# Altium schematic sheet A-01 BLOCK DIAGRAM.SchDoc
size 513 x 386 mm
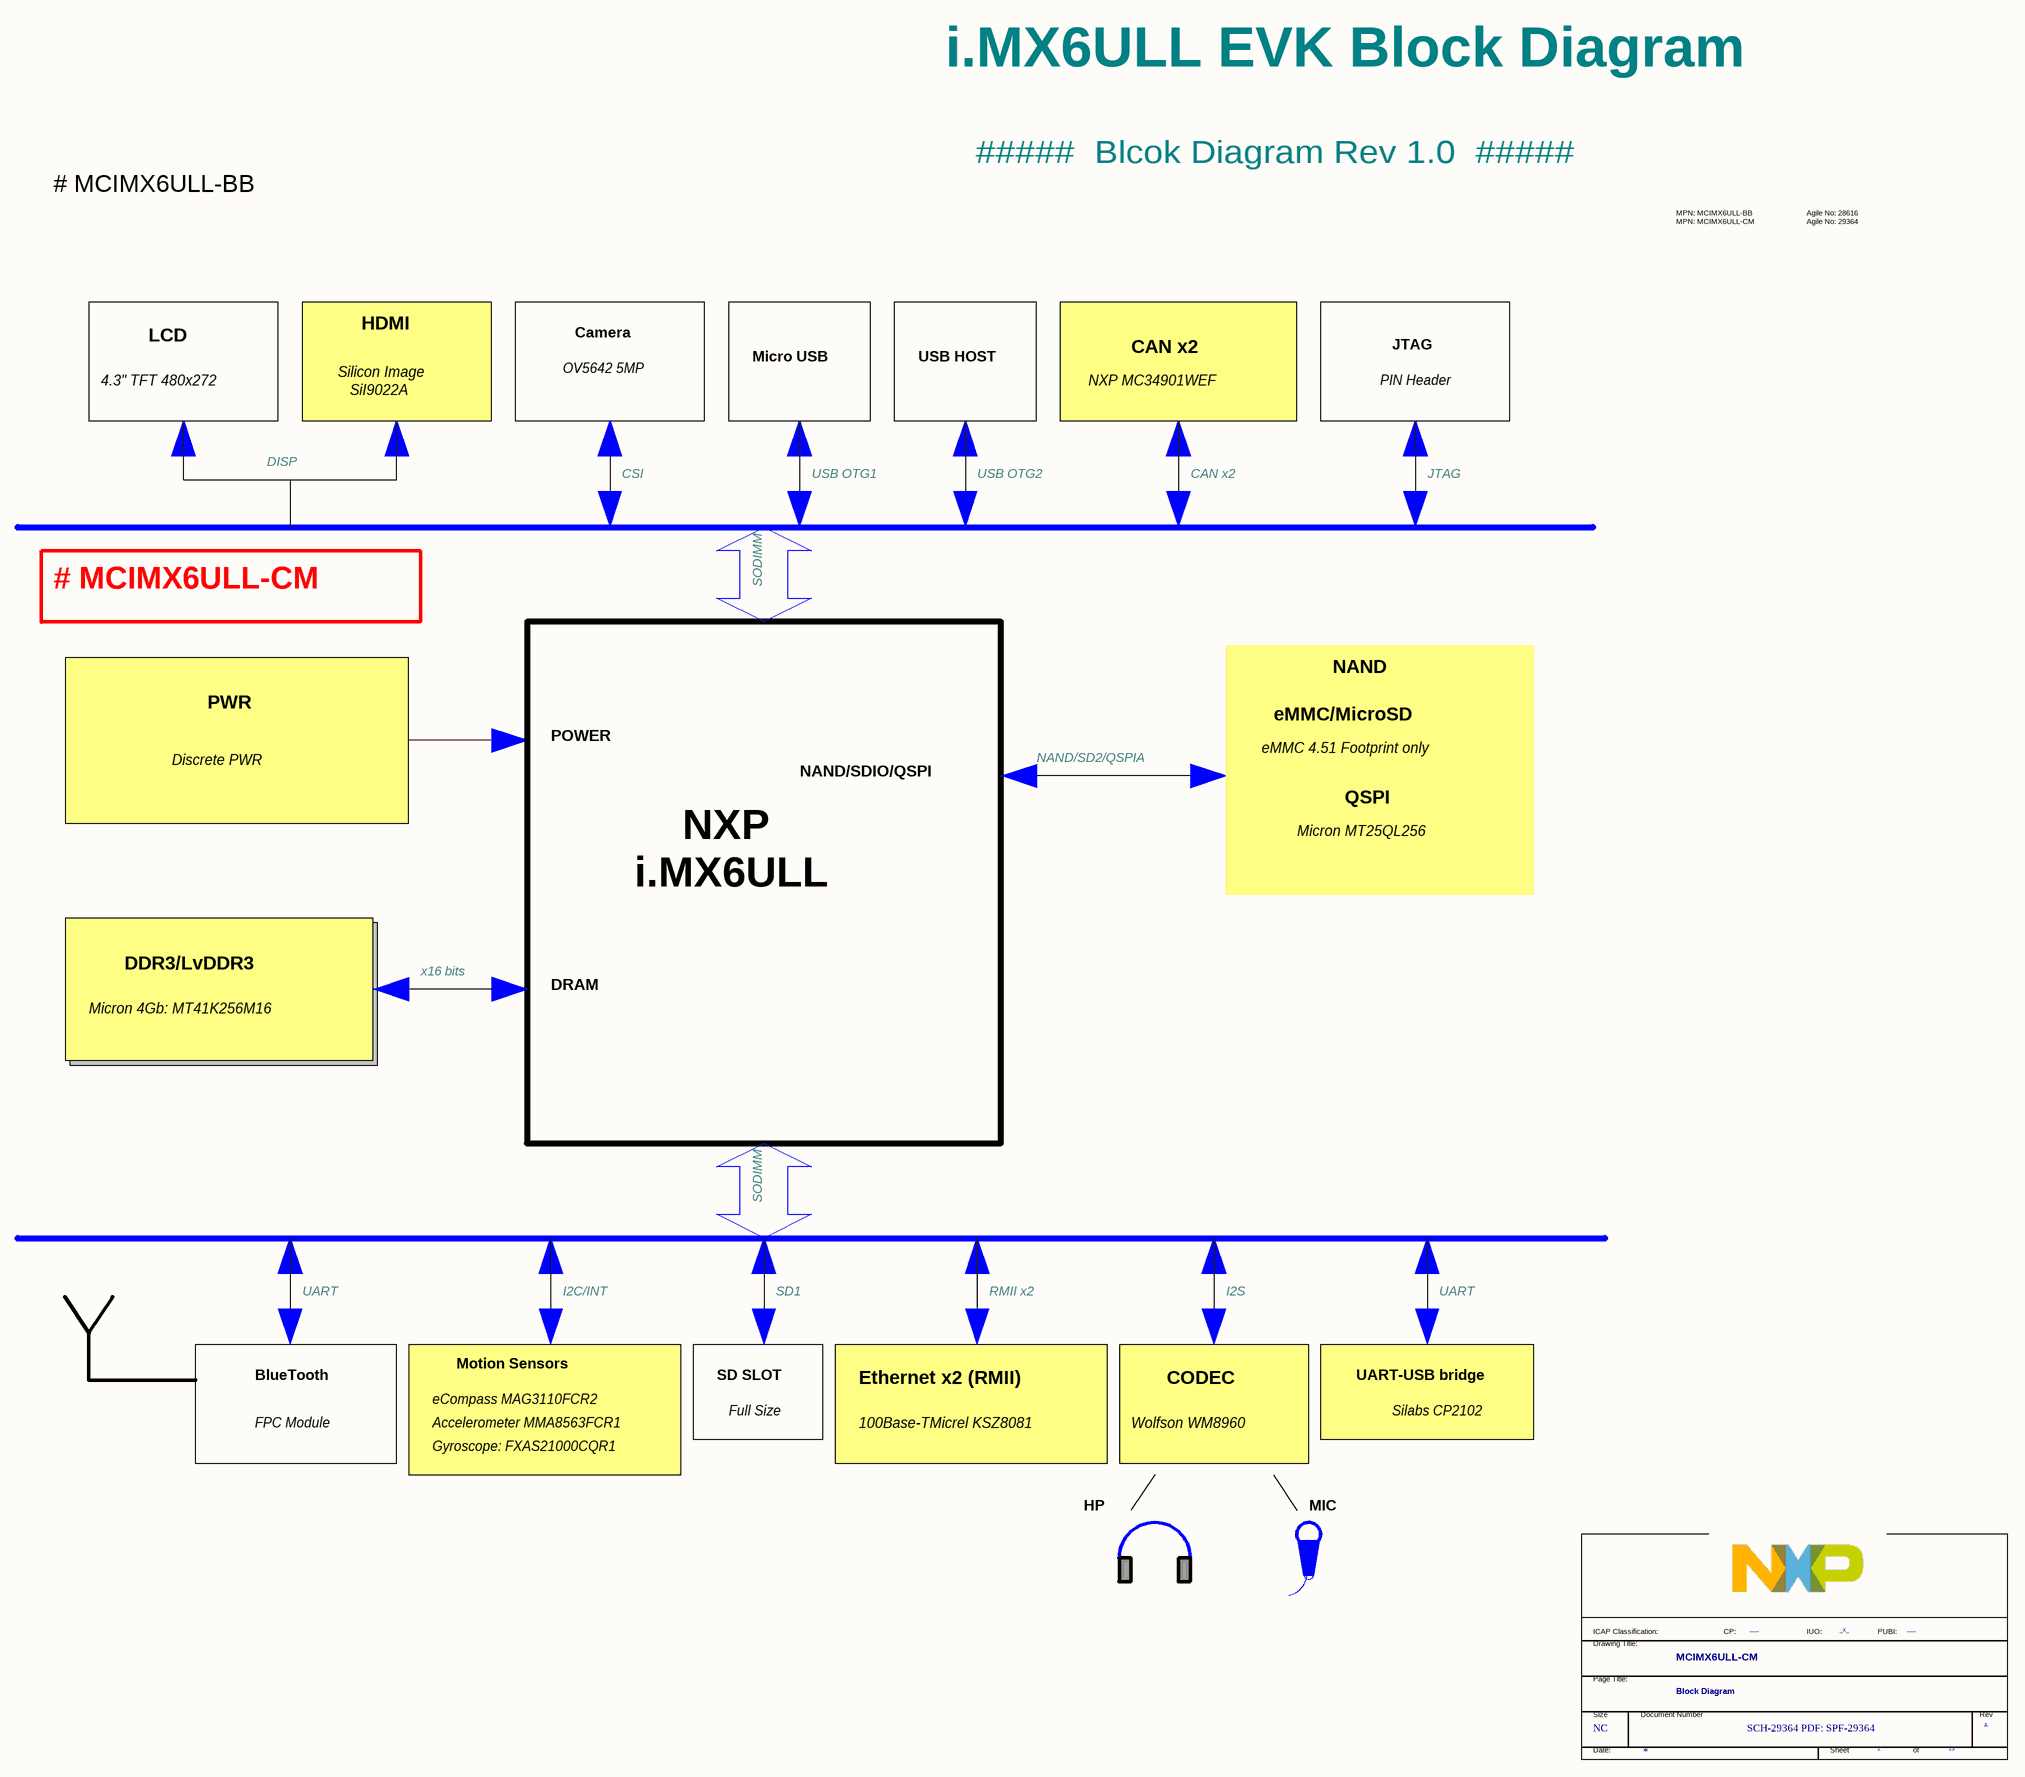
[diagram p0: A-01 BLOCK DIAGRAM.SchDoc]

## Parts
*  FIUO: _X_  PUBI: ___  Doc: SCH-29364 PDF: SPF-29364  RevCode: A  Title: MCIMX6ULL-CM  Page Size: NC  Page Number: 2  Page Count: 13  PageTitle: Block Diagram  (hidden comment: TitleBlock_FS)  (graphical)

## Notes on the sheet
- i.MX6ULL EVK Block Diagram
- # MCIMX6ULL-BB
- #####  Blcok Diagram Rev 1.0  #####
- MPN: MCIMX6ULL-BB
  MPN: MCIMX6ULL-CM
- Agile No: 28616
  Agile No: 29364
- LCD
- Silicon Image
  SiI9022A
- HDMI
- OV5642 5MP
- Camera
- Micro USB
- USB HOST
- CAN x2
- JTAG
- 4.3" TFT 480x272
- NXP MC34901WEF
- PIN Header
- DISP
- CSI
- USB OTG1
- USB OTG2
- # MCIMX6ULL-CM
- SODIMM
- PWR
- eMMC/MicroSD
- NAND
- Discrete PWR
- POWER
- NAND/SDIO/QSPI
- NAND/SD2/QSPIA
- eMMC 4.51 Footprint only
- NXP
  i.MX6ULL
- Micron MT25QL256
- QSPI
- Micron 4Gb: MT41K256M16
- DDR3/LvDDR3
- x16 bits
- DRAM
- UART
- I2C/INT
- SD1
- RMII x2
- I2S
- BlueTooth
- Motion Sensors
- SD SLOT
- UART-USB bridge
- FPC Module
- eCompass MAG3110FCR2
- Accelerometer MMA8563FCR1
- Full Size
- Ethernet x2 (RMII)
- 100Base-TMicrel KSZ8081
- Wolfson WM8960
- CODEC
- Silabs CP2102
- Gyroscope: FXAS21000CQR1
- HP
- MIC
- (in symbol TitleBlock_FS) ICAP Classification:; CP:; IUO:; PUBI:; Drawing Title:; Page Title:; Size; Document Number; Rev; Date:; Sheet; of

## Library data of the parts
* = TitleBlock_FS: OrgName: Freescale Semiconductor; OrgAddr1: 6501 William Cannon Drive West; OrgAddr2: Austin, TX 78735-8598; FCP: ___; Page Create Date: March  8, 1995; Page Modify Date: *